# Altium schematic sheet connection.SchDoc
size A
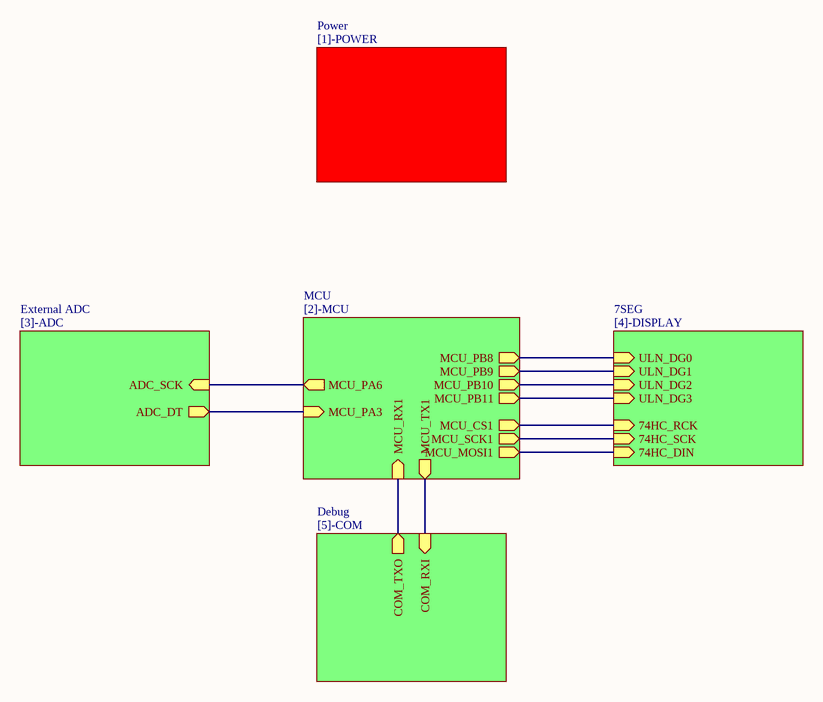
[diagram p0: connection.SchDoc]

## Sub-sheets
7SEG = [4]-DISPLAY: ULN_DG0 (in), ULN_DG1 (in), ULN_DG2 (in), ULN_DG3 (in), 74HC_DIN (in), 74HC_RCK (in), 74HC_SCK (in)
Debug = [5]-COM: COM_TXO (out), COM_RXI (in)
External ADC = [3]-ADC: ADC_SCK (in), ADC_DT (out)
MCU = [2]-MCU: MCU_PA6 (out), MCU_PA3 (in), MCU_TX1 (out), MCU_RX1 (in), MCU_PB8 (out), MCU_PB9 (out), MCU_PB10 (out), MCU_PB11 (out), MCU_CS1 (out), MCU_SCK1 (out), MCU_MOSI1 (out)
Power = [1]-POWER: no entries

## Nets
(unnamed): sheet MCU/MCU_PA6, sheet External ADC/ADC_SCK
(unnamed): sheet MCU/MCU_PA3, sheet External ADC/ADC_DT
(unnamed): sheet MCU/MCU_TX1, sheet Debug/COM_RXI
(unnamed): sheet MCU/MCU_RX1, sheet Debug/COM_TXO
(unnamed): sheet MCU/MCU_PB8, sheet 7SEG/ULN_DG0
(unnamed): sheet MCU/MCU_PB9, sheet 7SEG/ULN_DG1
(unnamed): sheet MCU/MCU_PB10, sheet 7SEG/ULN_DG2
(unnamed): sheet MCU/MCU_PB11, sheet 7SEG/ULN_DG3
(unnamed): sheet MCU/MCU_CS1, sheet 7SEG/74HC_RCK
(unnamed): sheet MCU/MCU_SCK1, sheet 7SEG/74HC_SCK
(unnamed): sheet MCU/MCU_MOSI1, sheet 7SEG/74HC_DIN